# Altium project ecg-go.PrjPCB
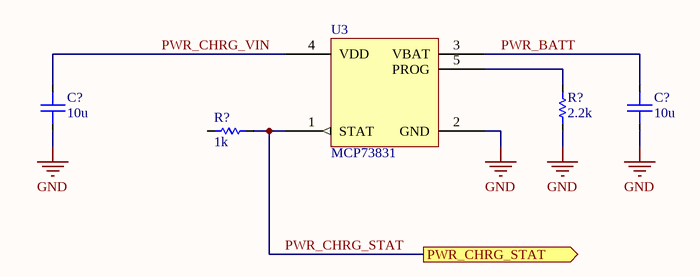
[diagram p0: batt_power.SchDoc]
5 sheets, 82 parts. Net scope: hierarchical (ports join the sheet entries above them; power ports are global).
Board file: ecg-go.PcbDoc
Sheets:
  batt_power.SchDoc
  main.SchDoc
    U_afe = afe.SchDoc
    U_core = core.SchDoc
      U_afe = afe.SchDoc
    U_user_interface = user_interface.SchDoc

## Sheet batt_power.SchDoc: Battery and regulation
size A4; Author: Samuel López; DocumentNumber: 4; SheetNumber: 4; SheetTotal: 5

### Parts
(Parts that share a designator on the sheet are numbered #1, #2 ... from top to bottom, then left to right.)
C?#1  10u  [C0603]
C?#2  10u  [C0603]
R?#1  2.2k  [R0402]
R?#2  1k  [R0402]
U3  MCP73831  [MCP7383X]

### Ports
PWR_CHRG_STAT (out)

### Nets
GND: C?#1.1 C?#2.1 R?#1.2 U3.2(GND)  [project net AGND]
PWR_BATT: C?#2.2 U3.3(VBAT)
PWR_CHRG_STAT: R?#2.1 U3.1(STAT) ; port PWR_CHRG_STAT
PWR_CHRG_VIN: C?#1.2 U3.4(VDD)
NetR?#1_1: R?#1.1 U3.5(PROG)

Not connected (* = marked no-connect by the designer): R?#2 2

### Notes on the sheet
- Title:
- Sheet
- of
- Author:
- Date:
- Time:

### Library data of the parts
C?#1 C?#2 = Capacitor: Value: 10u; Rated Voltage: *
R?#1 R?#2 = Resistor: Power: *
  R?#1: Value: 2.2k
  R?#2: Value: 1k
U3 = MCP73831: IC - Battery Charger, Single Cell Li-Ion/LiPo, 0.5A; Supplier 1: Digi-Key; Supplier Part Number 1: MCP73831T-2ACI/OTCT-ND

## Sheet main.SchDoc: Main
size A4; Author: Samuel López; DocumentNumber: 1; SheetNumber: 1; SheetTotal: 5
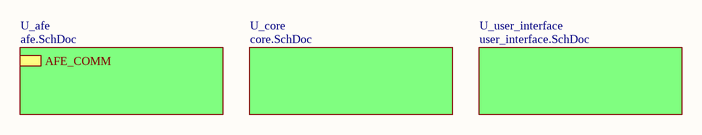
[diagram p1: main.SchDoc]

### Sub-sheets
U_afe = afe.SchDoc: AFE_COMM (harness AFE_COMM)
U_core = core.SchDoc: no entries
U_user_interface = user_interface.SchDoc: no entries

### Notes on the sheet
- Title:
- Sheet
- of
- Author:
- Date:
- Time:

## Sheet afe.SchDoc: AFE
size A4; Author: Samuel López; DocumentNumber: 3; SheetNumber: 3; SheetTotal: 6
Used 2 times, as channels U_afe, U_core/U_afe. Parts and nets are listed once, with the designators drawn on the sheet.
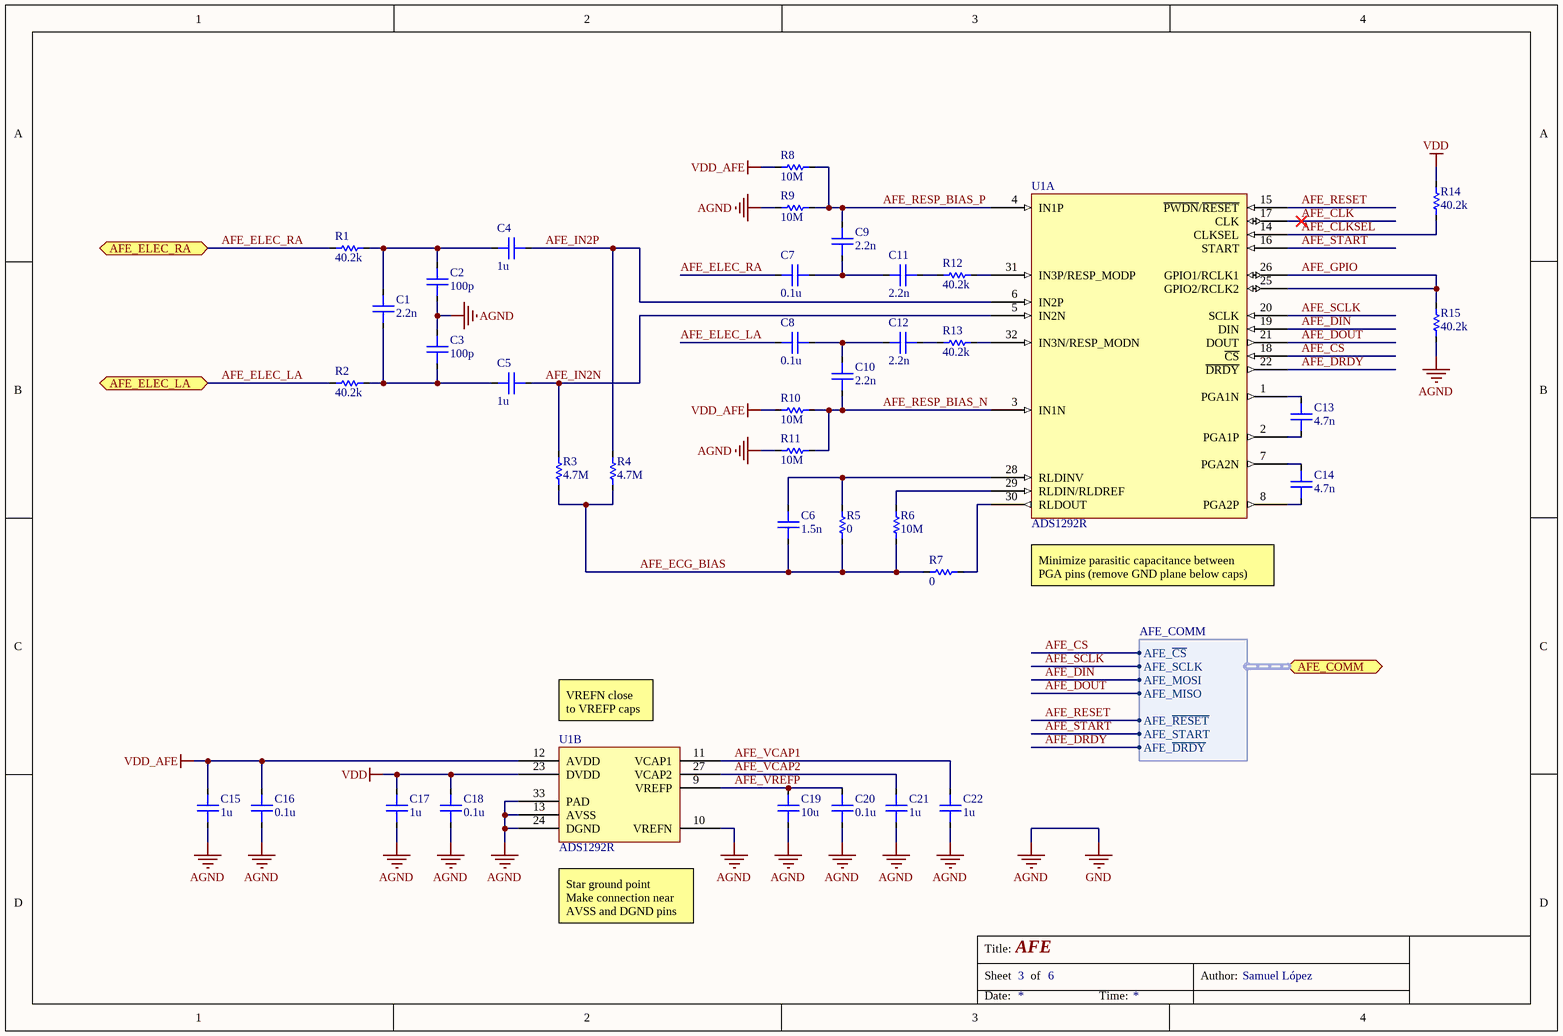
[diagram p2: afe.SchDoc]

### Parts
C1  2.2n  [C0402]
C2  100p  [C0402]
C3  100p  [C0402]
C4  1u  [C0402]
C5  1u  [C0402]
C6  1.5n  [C0402]
C7  0.1u  [C0402]
C8  0.1u  [C0402]
C9  2.2n  [C0402]
C10  2.2n  [C0402]
C11  2.2n  [C0402]
C12  2.2n  [C0402]
C13  4.7n  [C0402]
C14  4.7n  [C0402]
C15  1u  [C0402]
C16  0.1u  [C0402]
C17  1u  [C0402]
C18  0.1u  [C0402]
C19  10u  [C0603]
C20  0.1u  [C0402]
C21  1u  [C0402]
C22  1u  [C0402]
R1  40.2k  [R0402]
R2  40.2k  [R0402]
R3  4.7M  [R0402]
R4  4.7M  [R0402]
R5  0  [R0402]
R6  10M  [R0402]
R7  0  [R0402]
R8  10M  [R0402]
R9  10M  [R0402]
R10  10M  [R0402]
R11  10M  [R0402]
R12  40.2k  [R0402]
R13  40.2k  [R0402]
R14  40.2k  [R0402]
R15  40.2k  [R0402]
U1  ADS1292R  [ADS129x_QFN]  (parts A,B of 2)

### Ports
AFE_COMM (harness AFE_COMM), AFE_ELEC_LA (bidir), AFE_ELEC_RA (bidir)

### Harnesses
AFE_COMM: AFE_SCLK, AFE_MOSI, AFE_MISO, AFE_~{CS}, AFE_~{RESET}, AFE_START, AFE_~{DRDY}

### Nets
AGND: C2.2 C3.1 C15.1 C16.1 C17.1 C18.1 C19.1 C20.1 C21.1 C22.1 R9.2 R11.2 R15.1 U1.10(VREFN) U1.13(AVSS) U1.24(DGND) U1.33(PAD)  [also labelled GND]
VDD: C17.2 C18.2 R14.2 U1.23(DVDD)
VDD_AFE: C15.2 C16.2 R8.2 R10.2 U1.12(AVDD)
AFE_CLK: U1.17(CLK)
AFE_CLKSEL: R14.1 U1.14(CLKSEL)
AFE_CS: U1.18(~{CS}) ; port AFE_COMM.AFE_~{CS}
AFE_DIN: U1.19(DIN) ; port AFE_COMM.AFE_MOSI
AFE_DOUT: U1.21(DOUT) ; port AFE_COMM.AFE_MISO
AFE_DRDY: U1.22(~{DRDY}) ; port AFE_COMM.AFE_~{DRDY}
AFE_ECG_BIAS: C6.1 R3.1 R4.1 R5.1 R6.1 R7.2
AFE_ELEC_LA: C8.1 R2.2 ; port AFE_ELEC_LA
AFE_ELEC_RA: C7.2 R1.2 ; port AFE_ELEC_RA
AFE_GPIO: R15.2 U1.25(GPIO2/RCLK2) U1.26(GPIO1/RCLK1)
AFE_IN2N: C5.2 R3.2 U1.5(IN2N)
AFE_IN2P: C4.2 R4.2 U1.6(IN2P)
AFE_RESET: U1.15(~{PWDN}/~{RESET}) ; port AFE_COMM.AFE_~{RESET}
AFE_RESP_BIAS_N: C10.1 R10.1 R11.1 U1.3(IN1N)
AFE_RESP_BIAS_P: C9.1 R8.1 R9.1 U1.4(IN1P)
AFE_SCLK: U1.20(SCLK) ; port AFE_COMM.AFE_SCLK
AFE_START: U1.16(START) ; port AFE_COMM.AFE_START
AFE_VCAP1: C22.2 U1.11(VCAP1)
AFE_VCAP2: C21.2 U1.27(VCAP2)
AFE_VREFP: C19.2 C20.2 U1.9(VREFP)
NetC1_1: C1.1 C2.1 C4.1 R1.1
NetC1_2: C1.2 C3.2 C5.1 R2.1
NetC6_2: C6.2 R5.2 U1.28(RLDINV)
NetC7_1: C7.1 C9.2 C11.2
NetC8_2: C8.2 C10.2 C12.1
NetC11_1: C11.1 R12.2
NetC12_2: C12.2 R13.2
NetC13_1: C13.1 U1.2(PGA1P)
NetC13_2: C13.2 U1.1(PGA1N)
NetC14_1: C14.1 U1.8(PGA2P)
NetC14_2: C14.2 U1.7(PGA2N)
NetR6_2: R6.2 U1.29(RLDIN/RLDREF)
NetR7_1: R7.1 U1.30(RLDOUT)
NetR12_1: R12.1 U1.31(IN3P/RESP_MODP)
NetR13_1: R13.1 U1.32(IN3N/RESP_MODN)

### Channels
U_afe: designators C1=C1 C2=C2 C3=C3 C4=C4 C5=C5 C6=C12 C7=C6 C8=C7 C9=C8 C10=C9 C11=C10 C12=C11 C13=C13 C14=C14 C15=C15 C16=C16 C17=C17 C18=C18 C19=C19 C20=C20 C21=C21 C22=C22 R1=R1 R2=R2 R3=R3 R4=R4 R5=R11 R6=R12 R7=R13 R8=R5 R9=R6 R10=R7 R11=R8 R12=R9 R13=R10 R14=R14_U_afe R15=R15_U_afe U1=U2; ports AFE_ELEC_LA=AFE_ELEC_LA_U_afe AFE_ELEC_RA=AFE_ELEC_RA_U_afe
U_core/U_afe: designators end in _U_core_U_afe; ports AFE_ELEC_LA=AFE_ELEC_LA_U_afe AFE_ELEC_RA=AFE_ELEC_RA

### Notes on the sheet
- Minimize parasitic capacitance between
  PGA pins (remove GND plane below caps)
- (near U1) VREFN close
  to VREFP caps
- (near U1) Star ground point
  Make connection near AVSS and DGND pins
- Title:
- Sheet
- of
- Author:
- Date:
- Time:

### Library data of the parts
C1-C22 = Capacitor: Rated Voltage: *
  C1 C9-C12: Value: 2.2n
  C2 C3: Value: 100p
  C4 C5 C15 C17 C21 C22: Value: 1u
  C6: Value: 1.5n
  C7 C8 C16 C18 C20: Value: 0.1u
  C13 C14: Value: 4.7n
  C19: Value: 10u
R1-R15 = Resistor: Power: *
  R1 R2 R12-R15: Value: 40.2k
  R3 R4: Value: 4.7M
  R5 R7: Value: 0
  R6 R8-R11: Value: 10M
U1 = ADS1292R: IC - Analog Front End - Medical; Supplier 1: Digi-Key; Supplier Part Number 1: 296-35020-1-ND

## Sheet core.SchDoc: Core
size A4; Author: Samuel López; DocumentNumber: 1; SheetNumber: 1; SheetTotal: 6
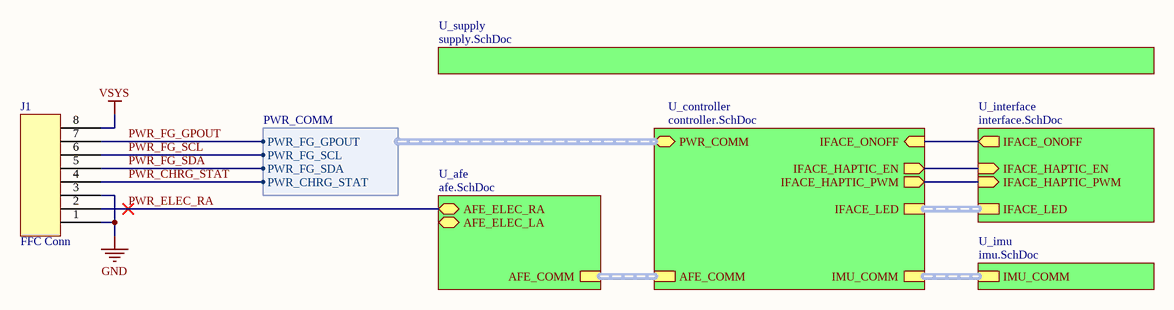
[diagram p3: core.SchDoc]

### Parts
J1  FFC Conn  [WE68610814122]

### Sub-sheets
U_afe = afe.SchDoc: AFE_COMM (harness AFE_COMM), AFE_ELEC_RA (bidir), AFE_ELEC_LA (bidir)
U_controller = controller.SchDoc (file not in this document): IFACE_HAPTIC_EN (out), IFACE_HAPTIC_PWM (out), IFACE_ONOFF (in), IFACE_LED (harness IFACE_LED), AFE_COMM (harness AFE_COMM), IMU_COMM (harness IMU_COMM), PWR_COMM (harness PWR_COMM)
U_imu = imu.SchDoc (file not in this document): IMU_COMM (harness IMU_COMM)
U_interface = interface.SchDoc (file not in this document): IFACE_LED (harness IFACE_LED), IFACE_ONOFF (out), IFACE_HAPTIC_EN (in), IFACE_HAPTIC_PWM (in)
U_supply = supply.SchDoc (file not in this document): no entries

### Harnesses
PWR_COMM: PWR_FG_GPOUT, PWR_FG_SCL, PWR_FG_SDA, PWR_CHRG_STAT

### Nets
GND: J1.1 J1.3  [project net AGND]
VSYS: J1.8
PWR_CHRG_STAT: J1.4 ; sheet U_controller/PWR_COMM.PWR_CHRG_STAT
PWR_ELEC_RA: J1.2 ; sheet U_afe/AFE_ELEC_RA  [project net AFE_ELEC_RA]
PWR_FG_GPOUT: J1.7 ; sheet U_controller/PWR_COMM.PWR_FG_GPOUT
PWR_FG_SCL: J1.6 ; sheet U_controller/PWR_COMM.PWR_FG_SCL
PWR_FG_SDA: J1.5 ; sheet U_controller/PWR_COMM.PWR_FG_SDA
(unnamed): sheet U_controller/IFACE_HAPTIC_EN, sheet U_interface/IFACE_HAPTIC_EN
(unnamed): sheet U_controller/IFACE_HAPTIC_PWM, sheet U_interface/IFACE_HAPTIC_PWM
(unnamed): sheet U_controller/IFACE_ONOFF, sheet U_interface/IFACE_ONOFF

### Buses and harness runs
harness sheet U_afe/AFE_COMM = sheet U_controller/AFE_COMM
harness sheet U_controller/IFACE_LED = sheet U_interface/IFACE_LED
harness sheet U_controller/IMU_COMM = sheet U_imu/IMU_COMM

### Notes on the sheet
- Title:
- Sheet
- of
- Author:
- Date:
- Time:

### Library data of the parts
J1 = WE68610814122: Conn - FFC, 8 Pin, 1 mm Pitch, Top Contacts, SMD, Right Angle, Slide Lock; Supplier 1: Digi-Key; Supplier Part Number 1: 732-2003-1-ND

## Sheet user_interface.SchDoc: User interface
size A4; Author: Samuel López; DocumentNumber: 4; SheetNumber: 4; SheetTotal: 4

### Notes on the sheet
- Title:
- Sheet
- of
- Author:
- Date:
- Time:

## Nets that join several sheets
AGND: batt_power (C?#1.1 C?#2.1 R?#1.2 U3.2), U_afe (17 pins), core (J1.1 J1.3), U_core/U_afe (17 pins)
VDD: U_afe (C17.2 C18.2 R14_U_afe.2 U2.23), U_core/U_afe (C17_U_core_U_afe.2 C18_U_core_U_afe.2 R14_U_core_U_afe.2 U1_U_core_U_afe.23)
VDD_AFE: U_afe (5 pins), U_core/U_afe (5 pins)
AFE_ELEC_RA: core (J1.2), U_core/U_afe (C7_U_core_U_afe.2 R1_U_core_U_afe.2)

## Assembly variants
Release: all parts fitted